# EAGLE design usb-xbee (EAGLE 5.03)
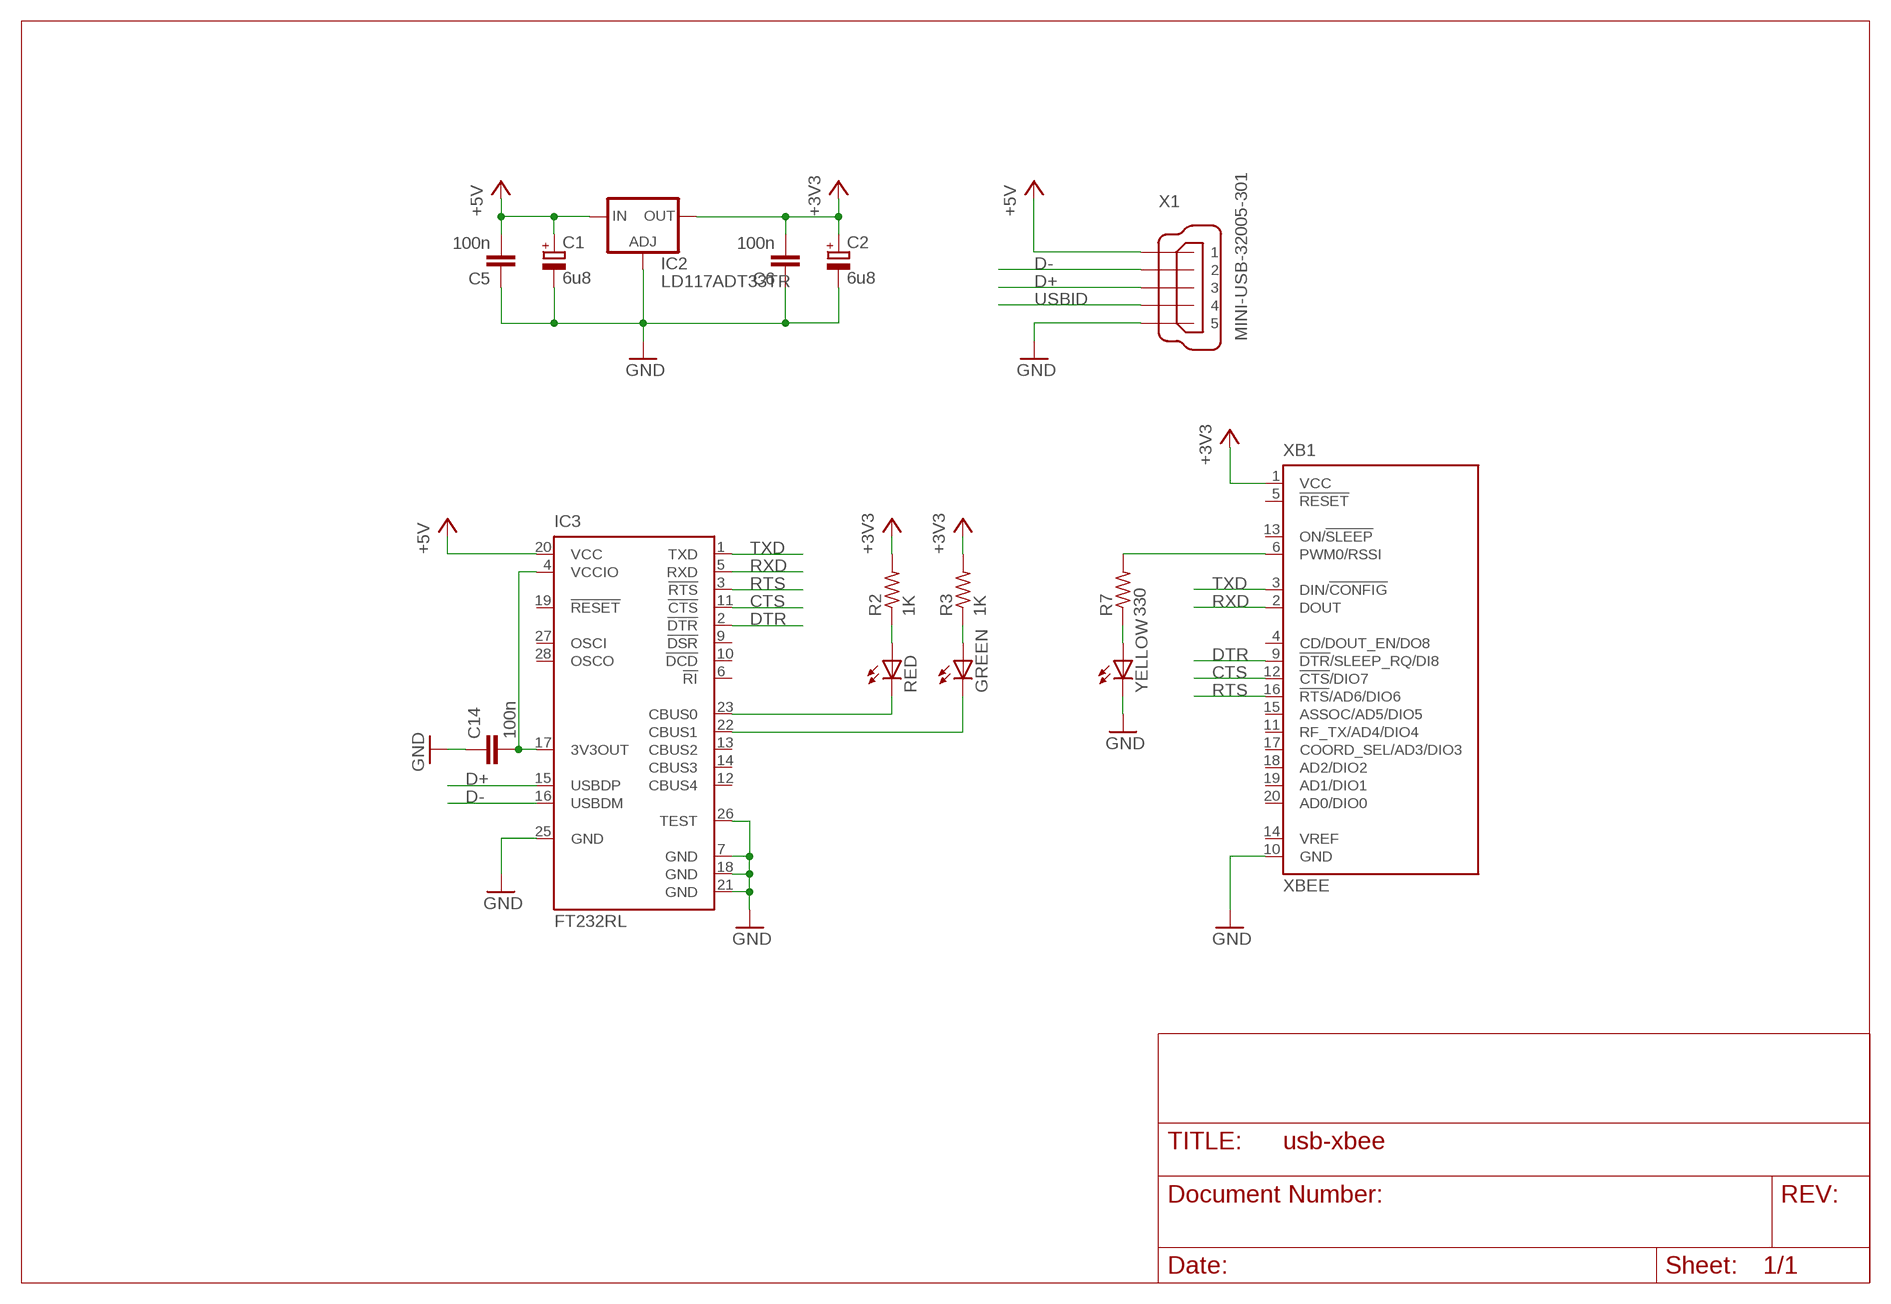
[diagram p0: schematic, sheet 1]

## Parts
C1  6u8  CPOL-EUSMCA  [SMC_A]
C2  6u8  CPOL-EUSMCA  [SMC_A]
C5  100n  C-EUC0805  [C0805]
C6  100n  C-EUC0805  [C0805]
C14  100n  C-EUC0805  [C0805]
GREEN  LEDSMT1206  [1206]
IC2  LD117ADT33TR  [DPACK]
IC3  FT232RL  [SSOP28]
R2  1K  R-US_R0805  [R0805]
R3  1K  R-US_R0805  [R0805]
R7  330  R-US_M0805  [M0805]
RED  LEDSMT1206  [1206]
X1  MINI-USB-32005-301  [32005-301]
XB1  XBEE  [XBEE-PRO2]
YELLOW  LEDSMT1206  [1206]

## Nets
+3V3: C2.+ C6.2 IC2.4(OUT) R2.2 R3.2 XB1.1(VCC)
+5V: C1.+ C5.2 IC2.3(IN) IC3.20(VCC) X1.1
CTS: IC3.11(!CTS) XB1.12(!CTS!/DIO7)
D+: IC3.15(USBDP) X1.3
D-: IC3.16(USBDM) X1.2
DTR: IC3.2(!DTR) XB1.9(!DTR!/SLEEP_RQ/DI8)
GND: C1.- C2.- C5.1 C6.1 C14.1 IC2.1(ADJ) IC3.7(GND) IC3.18(GND) IC3.21(GND) IC3.25(GND) IC3.26(TEST) X1.5 XB1.10(GND) YELLOW.C
N$3: GREEN.A R3.1
N$4: C14.2 IC3.4(VCCIO) IC3.17(3V3OUT)
N$7: R2.1 RED.A
N$10: IC3.23(CBUS0) RED.C
N$11: GREEN.C IC3.22(CBUS1)
N$13: R7.1 YELLOW.A
N$15: R7.2 XB1.6(PWM0/RSSI)
RTS: IC3.3(!RTS) XB1.16(!RTS!/AD6/DIO6)
RXD: IC3.5(RXD) XB1.2(DOUT)
TXD: IC3.1(TXD) XB1.3(DIN/!CONFIG)
USBID: X1.4
Unconnected: IC3.6(!RI) IC3.9(!DSR) IC3.10(!DCD) IC3.12(CBUS4) IC3.13(CBUS2) IC3.14(CBUS3) IC3.19(!RESET) IC3.27(OSCI) IC3.28(OSCO) XB1.4(CD/DOUT_EN/DO8) XB1.5(!RESET) XB1.11(RF_TX/AD4/DIO4) XB1.13(ON/!SLEEP) XB1.14(VREF) XB1.15(ASSOC/AD5/DIO5) XB1.17(COORD_SEL/AD3/DIO3) XB1.18(AD2/DIO2) XB1.19(AD1/DIO1) XB1.20(AD0/DIO0)

## Library data of the parts
C1 C2 = rcl:CPOL-EU: POLARIZED CAPACITOR, European symbol
C5 C6 C14 = rcl:C-EU: CAPACITOR, European symbol
GREEN RED YELLOW = led:LED: LED OSRAM: - CHIPLED LG R971, LG N971, LY N971, LG Q971, LY Q971, LO R971, LY R971 LH N974, LH R974 LS Q976, LO Q976, LY Q976 LO Q996 - Hyper CHIPLED LW Q18S LB Q993, LB Q99A, LB R99A - SideLED LS A670, LO A670, LY A670, LG A670, LP A670 LB A673, LV A673, LT A673, LW A673 LH A674 LY A675 LS A676, LA A676, LO A676, LY A676, LW A676 LS A679, LY A679, LG A679 - Hyper Micro SIDELED® LS Y876, LA Y876, LO Y876, LY Y876 LT Y87S - SmartLED LW L88C, LW L88S LB L89C, LB L89S, LG L890 LS L89K, LO L89K, LY L89K LS L896, LA L896, LO L896, LY L896 - TOPLED LS T670, LO T670, LY T670, LG T670, LP T670 LSG T670, LSP T670, LSY T670, LOP T670, LYG T670 LG T671, LOG T671, LSG T671 LB T673, LV T673, LT T673, LW T673 LH T674 LS T676, LA T676, LO T676, LY T676, LB T676, LH T676, LSB T676, LW T676 LB T67C, LV T67C, LT T67C, LS T67K, LO T67K, LY T67K, LW E67C LS E67B, LA E67B, LO E67B, LY E67B, LB E67C, LV E67C, LT E67C LW T67C LS T679, LY T679, LG T679 LS T770, LO T770, LY T770, LG T770, LP T770 LB T773, LV T773, LT T773, LW T773 LH T774 LS E675, LA E675, LY E675, LS T675 LS T776, LA T776, LO T776, LY T776, LB T776 LHGB T686 LT T68C, LB T68C - Hyper Mini TOPLED® LB M676 - Mini TOPLED Santana® LG M470 LS M47K, LO M47K, LY M47K Source: http://www.osram.convergy.de LUXEON: - LUMILED® LXK2-PW12-R00, LXK2-PW12-S00, LXK2-PW14-U00, LXK2-PW14-V00 LXK2-PM12-R00, LXK2-PM12-S00, LXK2-PM14-U00 LXK2-PE12-Q00, LXK2-PE12-R00, LXK2-PE12-S00, LXK2-PE14-T00, LXK2-PE14-U00 LXK2-PB12-K00, LXK2-PB12-L00, LXK2-PB12-M00, LXK2-PB14-N00, LXK2-PB14-P00, LXK2-PB14-Q00 LXK2-PR12-L00, LXK2-PR12-M00, LXK2-PR14-Q00, LXK2-PR14-R00 LXK2-PD12-Q00, LXK2-PD12-R00, LXK2-PD12-S00 LXK2-PH12-R00, LXK2-PH12-S00 LXK2-PL12-P00, LXK2-PL12-Q00, LXK2-PL12-R00 Source: www.luxeon.com KINGBRIGHT: KA-3528ASYC Source: www.kingbright.com
IC2 = v-reg:LD117A?*: Low drop fixed and adjustable positive voltage regulators 1 A Source: http://www.st.com/stonline/products/literature/ds/7194/ld1117axx.pdf
IC3 = ftdichip:FT232R: Source: http://www.ftdichip.com/Documents/DataSheets/DS_FT232R_v104.pdf
R2 R3 R7 = rcl:R-US_: RESISTOR, American symbol
X1 = con-cypressindustries:MINI-USB-: MINI USB-B Conector Source: www.cypressindustries.com
XB1 = maxstream:XBEE: XBee (TM) /XBee-PRO(TM) OEM RF Modules Source: MaxStream, Inc. xbee_productmanual.pdf

## Board
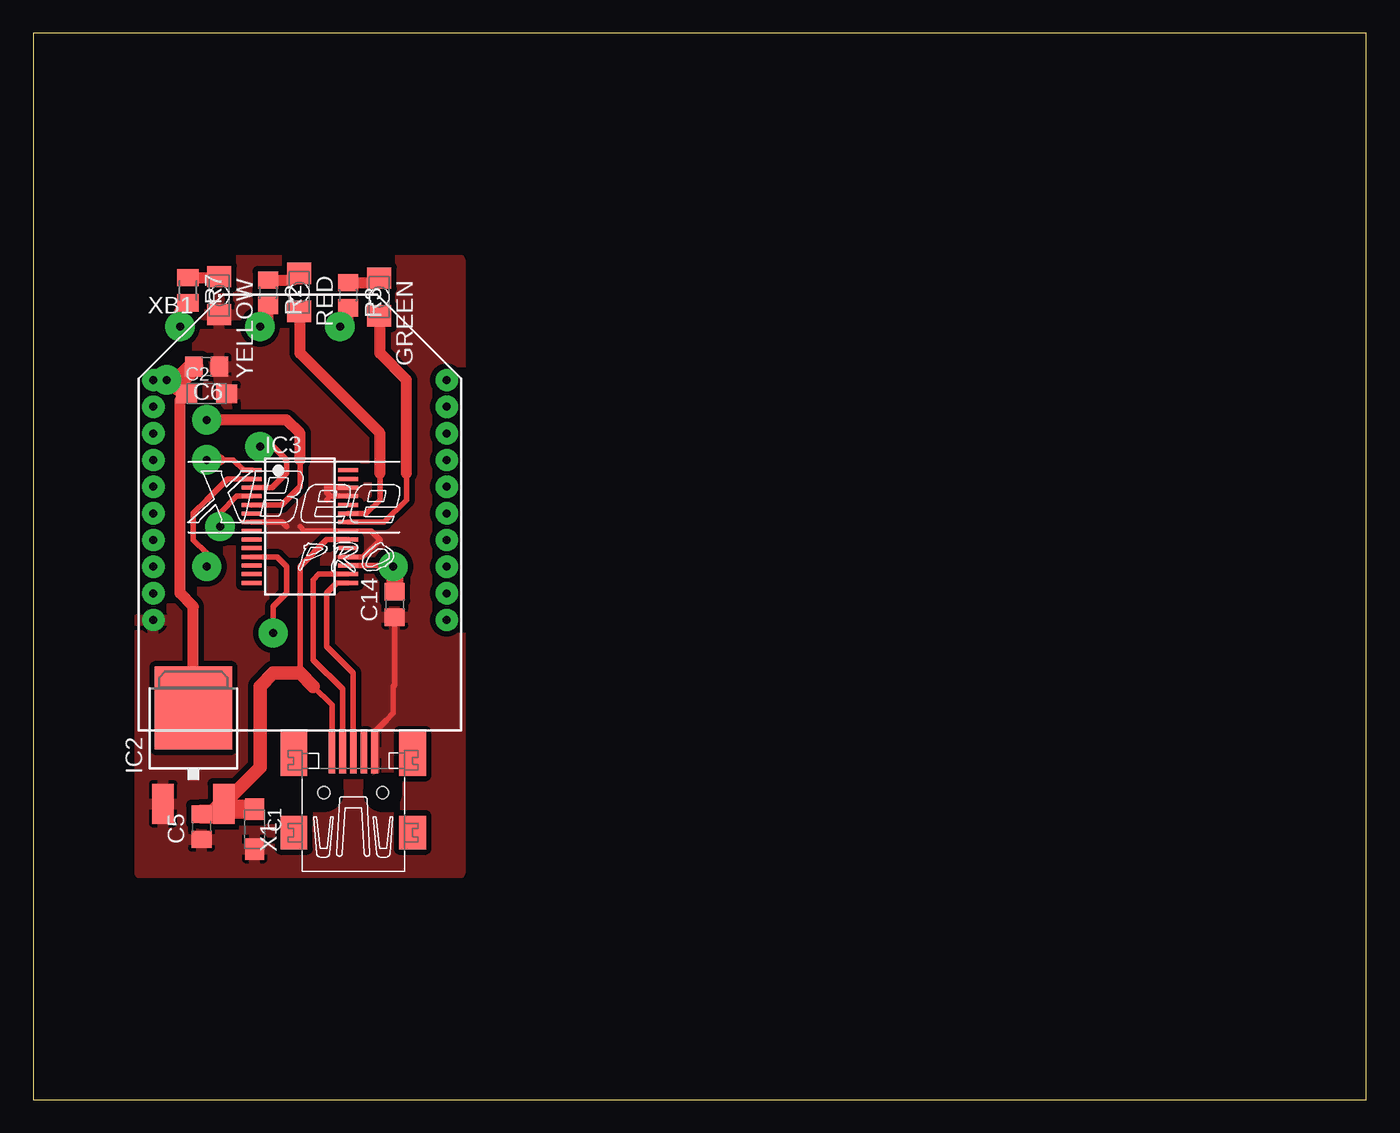
[diagram p1: board, top side]
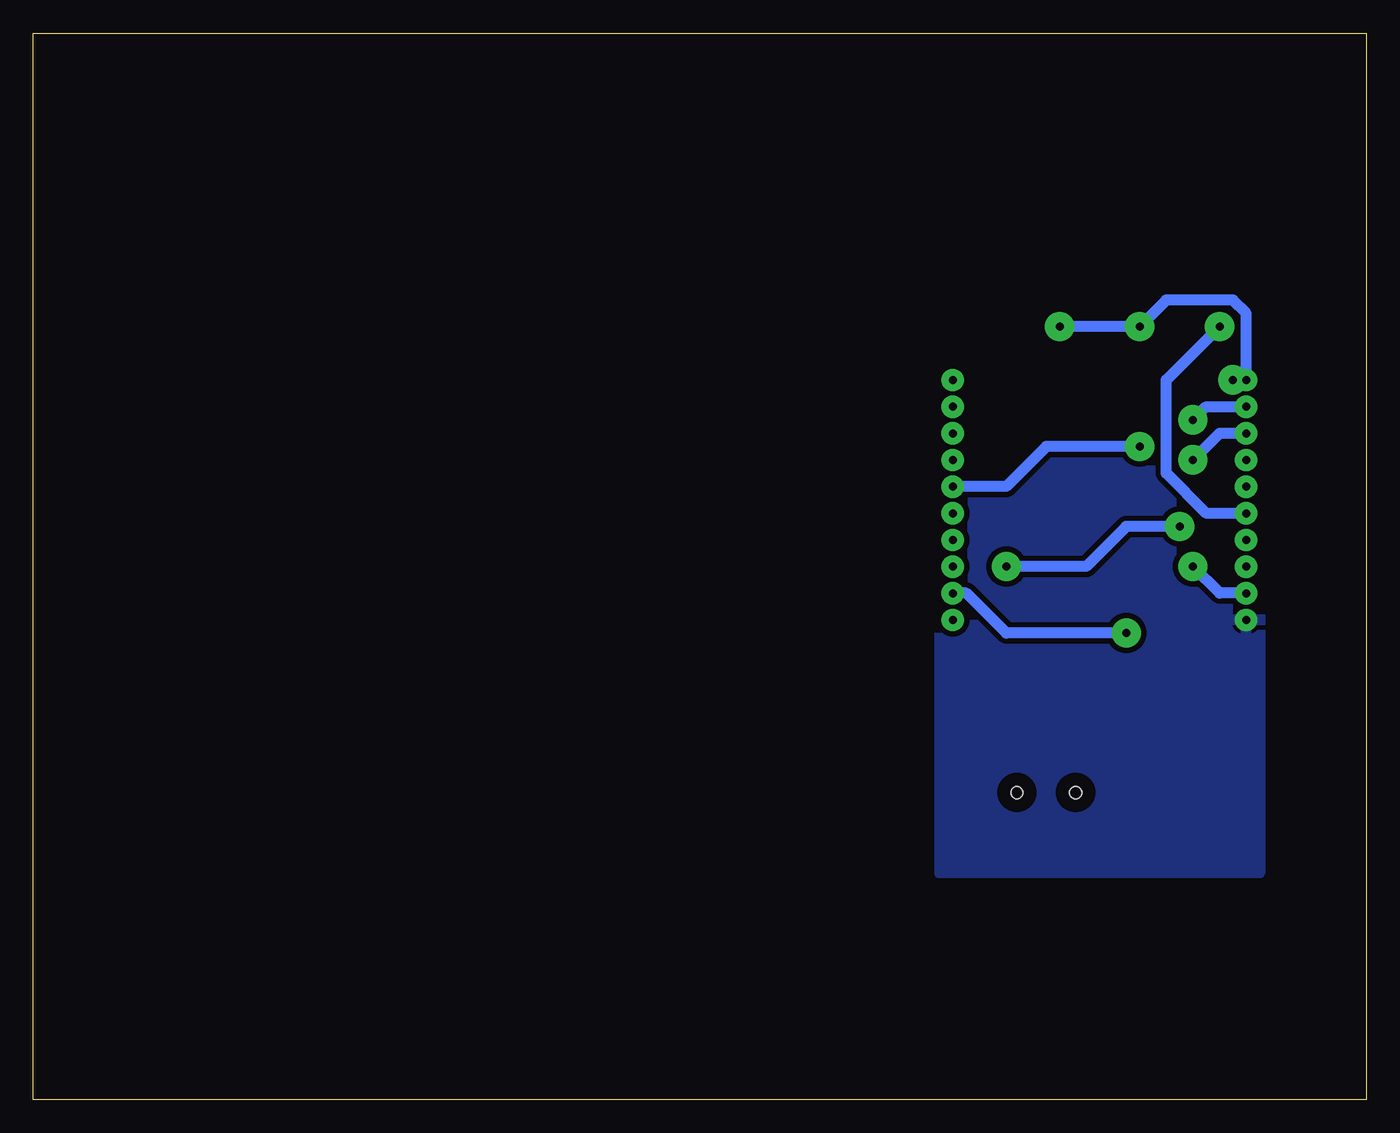
[diagram p2: board, bottom side, seen from below]

Size 100 x 80 mm. Coordinates in mm from the lower left corner, seen from the top.
Outline: 0,0 100,0 100,80 0,80 0,0
Copper layers (1*16): Top 0.035mm / dielectric 1.5mm / Bottom 0.035mm
Design rules "default": minimum track width 10mil, minimum drill 24mil, track to track 8mil, track to pad 8mil, pad to pad 8mil, via to via 8mil, smd to smd 8mil, copper to edge 40mil, drill to drill 8mil, minimum pad ring 10mil, minimum via ring 8mil, stop-mask expansion 4mil, vias tented up to drill 0mil, thermal gap 10mil

### Footprints (pad centres in the part's own frame; a part is rotated, then mirrored left to right if it is on the bottom)
SMC_A = smd 1.6 x 1.4: + -1.5,0; - 1.5,0
C0805 = smd 1.3 x 1.5: 1 -0.95,0; 2 0.95,0
1206 = smd 1.6 x 1.803: A -1.422,0; C 1.422,0
DPACK = smd 1.6 x 3: 1 -2.28,-4.8; 3 2.28,-4.8 | smd 5.8 x 6.2: 4 0,2.38
SSOP28 = smd 0.3 x 1.5: 1 -4.225,-3.625; 2 -3.575,-3.625; 3 -2.925,-3.625; 4 -2.275,-3.625; 5 -1.625,-3.625; 6 -0.975,-3.625; 7 -0.325,-3.625; 8 0.325,-3.625; 9 0.975,-3.625; 10 1.625,-3.625; 11 2.275,-3.625; 12 2.925,-3.625; 13 3.575,-3.625; 14 4.225,-3.625; 15 4.225,3.625; 16 3.575,3.625; 17 2.925,3.625; 18 2.275,3.625; 19 1.625,3.625; 20 0.975,3.625; 21 0.325,3.625; 22 -0.325,3.625; 23 -0.975,3.625; 24 -1.625,3.625; 25 -2.275,3.625; 26 -2.925,3.625; 27 -3.575,3.625; 28 -4.225,3.625
R0805 = smd 1.3 x 1.5: 1 -0.95,0; 2 0.95,0
M0805 = smd 1.3 x 1.6: 1 -0.95,0; 2 0.95,0
32005-301 = smd 3.1 x 0.5: 1 3,1.6; 2 3,0.8; 3 3,0; 4 3,-0.8; 5 3,-1.6 | smd 2.5 x 2: M1 -3,-4.45; M2 -3,4.45 | smd 3.3 x 2: M3 2.9,4.45; M4 2.9,-4.45 | hole 0.9: 0,2.2; 0,-2.2
XBEE-PRO2 = drill 0.6 pad 1.676 round: 1 -11,9; 2 -11,7; 3 -11,5; 4 -11,3; 5 -11,1; 6 -11,-1; 7 -11,-3; 8 -11,-5; 9 -11,-7; 10 -11,-9; 11 11,-9; 12 11,-7; 13 11,-5; 14 11,-3; 15 11,-1; 16 11,1; 17 11,3; 18 11,5; 19 11,7; 20 11,9

### Placement (x,y rotation side)
C1  16.61,20.29 270 top
C2  13.01,52.96 0 top
C5  12.63,20.47 90 top
C6  13,54.99 180 top
C14  27.12,37.14 90 top
GREEN  25.96,60.21 270 top
IC2  12.01,27 0 top
IC3  20.01,42.99 270 top
R2  17.61,60.53 270 top
R3  23.61,60.34 270 top
R7  11.61,60.72 270 top
RED  19.96,60.56 270 top
X1  24,23.03 90 top
XB1  20.01,44.98 0 top
YELLOW  13.96,60.32 270 top

### Tracks (layer width: path | path; a pad name or v marks a point on that pad's centre or on a via)
+3V3  (via drill 0.6 pad 2.18)
  Top 0.813: 10.49,53.98 10.02,53.98 v10,54 | IC2.4 12.01,36.99 11,38 11,52.45 C2.+ | R3.2 23.61,58.61 v23,58 | R2.2 17.61,58.61 v17,58
  Top 1.422: C2.+ 10.73,53.73 | 10.73,53.73 10.49,53.98 | C6.2 11.99,54.99 10.73,53.73
  Bottom 0.813: v10,54 9.98,53.98 XB1.1 9,54 9,59 10,60 15,60 v17,58 v23,58
+5V
  Top 0.406: X1.1 22.4,29.6 21,31 | IC3.20 22.02,42.02 20,40 20,32
  Top 1.016: 21,31 20,32 18,32 17,31 17,24.91 IC2.3
  Top 1.422: C5.2 13.51,21.42 IC2.3 14.7,21.79 C1.+
CTS  (via drill 0.6 pad 2.18)
  Top 0.406: IC3.11 18.28,40.72 19,40 19,38 18,37 v18,35
  Bottom 0.305: 31,38 XB1.12
  Bottom 0.813: v18,35 27,35 30,38 31,38
D+
  Top 0.406: IC3.15 22.77,38.77 22,38 22,34 24,32 X1.3
D-
  Top 0.406: X1.2 23.2,30.8 21,33 21,39 21.42,39.42 IC3.16
DTR  (via drill 0.6 pad 2.18)
  Top 0.406: IC3.2 14.57,46.57 13,45 12,44 12,42 13,41 v13,40
  Bottom 0.813: v13,40 11,38 9.03,38 XB1.9
GND
  Top 0.406: IC3.7 18.68,43.32 19,43 | 20,43 20.33,42.67 IC3.21 25.33,42.67 26,42 24.72,40.72 IC3.18 | 22.27,45.27 IC3.25 | 22.27,45.27 22,45 | IC3.26 22.08,45.92 22,46 22,45.53 22.27,45.27 | C14.1 27.12,31.12 27,31 27,29 26.5,28.5 | 26.5,28.5 26,28 | X1.5 25.6,27.6 26.5,28.5
  pour Top (isolate 0.406): 8,17 8,63 32,63 32,17
  pour Bottom (isolate 0.406): 8,17 32,17 32,63 8,63
N$3
  Top 0.813: R3.1 25.62,61.29 GREEN.A
N$4  (via drill 0.6 pad 2.18)
  Top 0.305: v27,40 26.93,40.07
  Top 0.406: IC3.4 15.27,45.27 14,44 v14,43 | 26.93,40.07 IC3.17
  Top 1.27: C14.2 27.12,39.88 v27,40
  Bottom 0.813: v14,43 18,43 21,40 v27,40
N$7
  Top 0.813: R2.1 19.46,61.48 RED.A
N$10
  Top 0.406: IC3.23 24.97,43.97 26,45 26,47
  Top 0.813: 26,47 26,50 20,56 20,59.1 RED.C
N$11
  Top 0.406: IC3.22 26.32,43.32 28,45 28,47
  Top 0.813: 28,47 28,54 26,56 26,58.75 GREEN.C
N$13
  Top 0.813: R7.1 13.89,61.67 YELLOW.A
N$15  (via drill 0.6 pad 2.18)
  Top 0.813: v11,58 11,59.16 R7.2
  Bottom 0.813: XB1.6 11.98,43.98 15,47 15,54 v11,58
RTS  (via drill 0.6 pad 2.18)
  Top 0.406: IC3.3 17.92,45.92 19,47 19,48 18,49 v17,49
  Bottom 0.305: 31,46 XB1.16
  Bottom 0.813: v17,49 24,49 27,46 31,46
RXD  (via drill 0.6 pad 2.18)
  Top 0.406: IC3.5 18.62,44.62 20,46 20,48
  Top 0.813: 20,48 20,50 19,51 v13,51
  Bottom 0.813: XB1.2 12.02,51.98 v13,51
TXD  (via drill 0.6 pad 2.18)
  Top 0.406: IC3.1 15.78,47.22 15,48 14,48
  Top 0.813: v13,48 14,48
  Bottom 0.813: XB1.3 11.02,49.98 v13,48